# Altium schematic sheet Power.SchDoc
size 406 x 304 mm; SheetNumber: 2; SheetTotal: 8
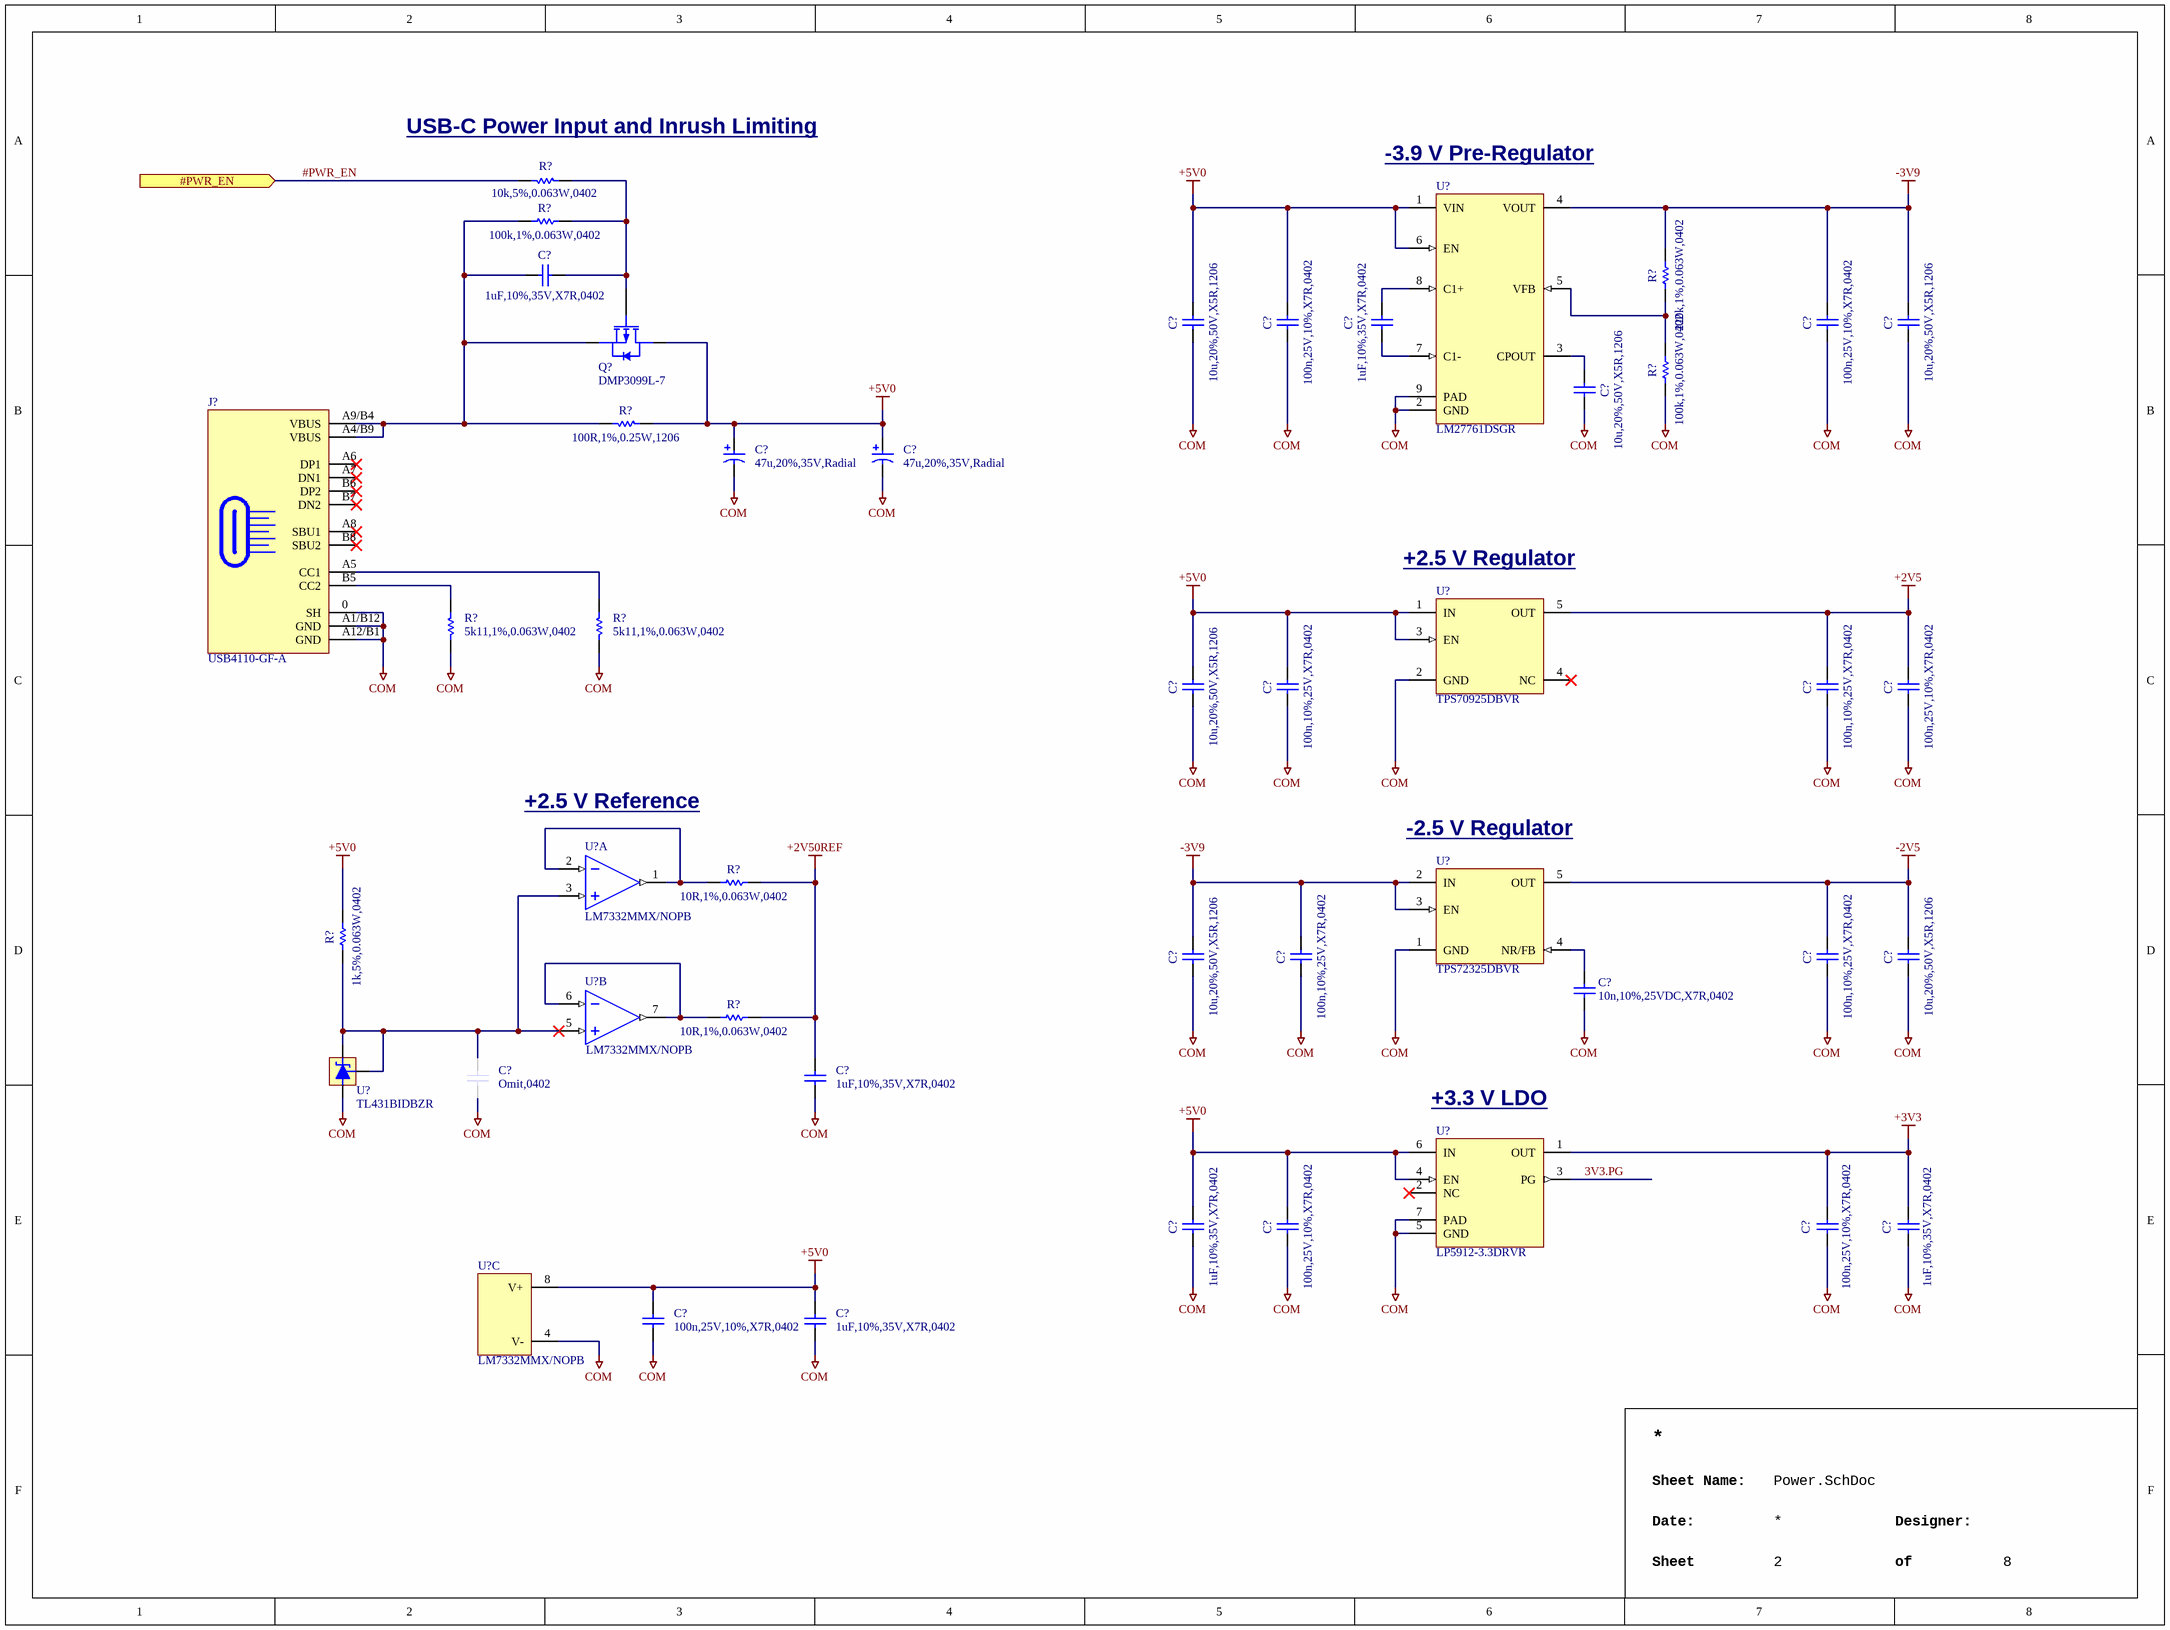
[diagram p0: Power.SchDoc]

## Parts
(Parts that share a designator on the sheet are numbered #1, #2 ... from top to bottom, then left to right.)
C?#1  1uF,10%,35V,X7R,0402  [CAPC1005X06N]
C?#2  10u,20%,50V,X5R,1206  [CAPC3216X16N]
C?#3  100n,25V,10%,X7R,0402  [CAPC1005X06N]
C?#4  1uF,10%,35V,X7R,0402  [CAPC1005X06N]
C?#5  100n,25V,10%,X7R,0402  [CAPC1005X06N]
C?#6  10u,20%,50V,X5R,1206  [CAPC3216X16N]
C?#7  10u,20%,50V,X5R,1206  [CAPC3216X16N]
C?#8  47u,20%,35V,Radial  [KEMET_ESKXXXXXXXXC3XX]
C?#9  47u,20%,35V,Radial  [KEMET_ESKXXXXXXXXC3XX]
C?#10  10u,20%,50V,X5R,1206  [CAPC3216X16N]
C?#11  100n,10%,25V,X7R,0402  [CAPC1005X06N]
C?#12  100n,10%,25V,X7R,0402  [CAPC1005X06N]
C?#13  100n,25V,10%,X7R,0402  [CAPC1005X06N]
C?#14  10u,20%,50V,X5R,1206  [CAPC3216X16N]
C?#15  100n,10%,25V,X7R,0402  [CAPC1005X06N]
C?#16  100n,10%,25V,X7R,0402  [CAPC1005X06N]
C?#17  10u,20%,50V,X5R,1206  [CAPC3216X16N]
C?#18  10n,10%,25VDC,X7R,0402  [CAPC1005X06N]
C?#19  Omit,0402  [CAPC1005X06N]  (no BOM)
C?#20  1uF,10%,35V,X7R,0402  [CAPC1005X06N]
C?#21  1uF,10%,35V,X7R,0402  [CAPC1005X06N]
C?#22  100n,25V,10%,X7R,0402  [CAPC1005X06N]
C?#23  100n,25V,10%,X7R,0402  [CAPC1005X06N]
C?#24  1uF,10%,35V,X7R,0402  [CAPC1005X06N]
C?#25  100n,25V,10%,X7R,0402  [CAPC1005X06N]
C?#26  1uF,10%,35V,X7R,0402  [CAPC1005X06N]
J?  USB4110-GF-A  [GCT_USB4110-GF-A]
Q?  DMP3099L-7  [DIODES_SOT23]
R?#1  10k,5%,0.063W,0402  [RESC1005X04N]
R?#2  100k,1%,0.063W,0402  [RESC1005X04N]
R?#3  220k,1%,0.063W,0402  [RESC1005X04N]
R?#4  100k,1%,0.063W,0402  [RESC1005X04N]
R?#5  100R,1%,0.25W,1206  [SEI_PKG_RMCF1206]
R?#6  5k11,1%,0.063W,0402  [RESC1005X04N]
R?#7  5k11,1%,0.063W,0402  [RESC1005X04N]
R?#8  10R,1%,0.063W,0402  [RESC1005X04N]
R?#9  1k,5%,0.063W,0402  [RESC1005X04N]
R?#10  10R,1%,0.063W,0402  [RESC1005X04N]
U?#1  LM27761DSGR  [TEXASINSTRUMENTS_PKG_DSG0008A]
U?#2  TPS70925DBVR  [TEXASINSTRUMENTS_PKG_DBV0005A]
U?#3  LM7332MMX/NOPB  [TEXASINSTRUMENTS_PKG_DGK0008A]  (part A of 3)
U?#4  TPS72325DBVR  [TEXASINSTRUMENTS_PKG_DBV0005A]
U?#5  LM7332MMX/NOPB  [TEXASINSTRUMENTS_PKG_DGK0008A]  (part B of 3)
U?#6  TL431BIDBZR  [SOT95P240X120-3N]
U?#7  LP5912-3.3DRVR  [SON65P200X80-6N]
U?#8  LM7332MMX/NOPB  [TEXASINSTRUMENTS_PKG_DGK0008A]  (part C of 3)

## Ports
#PWR_EN (in)

## Nets
+2V5: C?#12.2 C?#13.2 U?#2.5(OUT)
+2V50REF: C?#20.2 R?#8.2 R?#10.2
+3V3: C?#23.2 C?#24.2 U?#7.1(OUT)
+5V0: C?#2.2 C?#3.2 C?#8.1 C?#9.1 C?#10.2 C?#11.2 C?#21.2 C?#22.2 C?#25.2 C?#26.2 Q?.3(D) R?#5.1 R?#9.2 U?#1.1(VIN) U?#1.6(EN) U?#2.1(IN) U?#2.3(EN) U?#7.4(EN) U?#7.6(IN) U?#8.8(V+)
-2V5: C?#16.2 C?#17.2 U?#4.5(OUT)
-3V9: C?#5.2 C?#6.2 C?#14.2 C?#15.2 R?#3.1 U?#1.4(VOUT) U?#4.2(IN) U?#4.3(EN)
COM: C?#2.1 C?#3.1 C?#5.1 C?#6.1 C?#7.1 C?#8.2 C?#9.2 C?#10.1 C?#11.1 C?#12.1 C?#13.1 C?#14.1 C?#15.1 C?#16.1 C?#17.1 C?#18.1 C?#19.1 C?#20.1 C?#21.1 C?#22.1 C?#23.1 C?#24.1 C?#25.1 C?#26.1 J?.0(SH) J?.A1/B12(GND) J?.A12/B1(GND) R?#4.2 R?#6.2 R?#7.2 U?#1.2(GND) U?#1.9(PAD) U?#2.2(GND) U?#4.1(GND) U?#6.3 U?#7.5(GND) U?#7.7(PAD) U?#8.4(V-)
3V3.PG: U?#7.3(PG)
#PWR_EN: R?#1.1 ; port #PWR_EN
NetC?#1_1: C?#1.1 Q?.1(G) R?#1.2 R?#2.2
NetC?#1_2: C?#1.2 J?.A4/B9(VBUS) J?.A9/B4(VBUS) Q?.2(S) R?#2.1 R?#5.2
NetC?#4_1: C?#4.1 U?#1.7(C1-)
NetC?#4_2: C?#4.2 U?#1.8(C1+)
NetC?#7_2: C?#7.2 U?#1.3(CPOUT)
NetC?#18_2: C?#18.2 U?#4.4(NR/FB)
NetC?#19_2: C?#19.2 R?#9.1 U?#3.3(INA+) U?#5.5(INB+) U?#6.1 U?#6.2
NetJ?_A5: J?.A5(CC1) R?#7.1
NetJ?_B5: J?.B5(CC2) R?#6.1
NetR?#3_2: R?#3.2 R?#4.1 U?#1.5(VFB)
NetR?#8_1: R?#8.1 U?#3.1(OUTA) U?#3.2(INA-)
NetR?#10_1: R?#10.1 U?#5.6(INB-) U?#5.7(OUTB)

Not connected (* = marked no-connect by the designer): J? A6(DP1)* A7(DN1)* A8(SBU1)* B6(DP2)* B7(DN2)* B8(SBU2)*; U?#2 4(NC)*; U?#7 2(NC)*

## Notes on the sheet
- (near R?#1) USB-C Power Input and Inrush Limiting
- (near U?#1) -3.9 V Pre-Regulator
- (near U?#2) +2.5 V Regulator
- +2.5 V Reference
- (near U?#4) -2.5 V Regulator
- (near U?#7) +3.3 V LDO
- Sheet Name:
- Date:
- Sheet
- Designer:
- of

## Library data of the parts
C?#1 C?#4 C?#20 C?#21 C?#24 C?#26 = CAP,Cer,1uF,35VDC,X5R,0402: 1 ï¿½F ï¿½10% 35V Ceramic Capacitor X5R 0402 (1005 Metric); Manufacturer 1: TDK Corporation; Manufacturer 1 Part Number: C1005X5R1V105K050BC; Vendor 1 Part Number: 445-9073-1-ND; Vendor 1: Digikey; Value: 1u; Part Name: CAP,Cer,1uF,35VDC,X5R,0402; CreatedBy: Judd Foster; HelpURL: https://product.tdk.com/info/en/catalog/datasheets/mlcc_commercial_general_en.pdf?ref_disty=digikey
C?#2 C?#6 C?#7 C?#10 C?#14 C?#17 = CAP,Cer,10uF,50VDC,X5R,1206: 10ï¿½F ï¿½20% 50V Ceramic Capacitor X5R 1206 (3216 Metric); Manufacturer 1: Samsung Electro-Mechanics; Manufacturer 1 Part Number: CL31A106MBHNNNE; Vendor 1 Part Number: 1276-6736-1-ND; Vendor 1: Digikey; Part Name: CAP,Cer,10uF,50VDC,X5R,1206; CreatedBy: Judd Foster; HelpURL: https://www.samsungsem.com/resources/file/global/support/product_catalog/MLCC.pdf; Value: 10u
C?#3 C?#5 C?#13 C?#22 C?#23 C?#25 = CAP,Cer,100nF,10%,25VDC,X7R,0402: 0.1ï¿½F ï¿½10% 25V Ceramic Capacitor X7R 0402 (1005 Metric); Manufacturer 1: Murata Electronics; Manufacturer 1 Part Number: GRM155R71E104KE14J; Vendor 1 Part Number: 490-14603-1-ND; Vendor 1: DigiKey; Value: 100nF; Part Name: CAP,Cer,100nF,10%,25VDC,X7R,0402; CreatedBy: Judd Foster; HelpURL: https://search.murata.co.jp/Ceramy/image/img/A01X/G101/ENG/GRM155R71E104KE14-01.pdf
C?#8 C?#9 = CAP,Alum,47uF,20%,35V,Radial: 47 ÂµF 35 V Aluminum Electrolytic Capacitors Radial, Can 2000 Hrs @ 85Â°C; Manufacturer 1: KEMET; Manufacturer 1 Part Number: ESK476M035AC3EA; Vendor 1 Part Number: 399-18276-1-ND; Vendor 1: Digikey; Part Name: CAP,Alum,47uF,20%,35V,Radial; CreatedBy: Judd Foster; HelpURL: https://connect.kemet.com:7667/gateway/IntelliData-ComponentDocumentation/1.0/download/datasheet/ESK476M035AC3EA; Value: 47u
C?#11 C?#12 C?#15 C?#16 = CAP,Cer,100nF,10%,25V,X7R,0402: 0.1ï¿½F ï¿½10% 25V Ceramic Capacitor X7R 0402 (1005 Metric); Manufacturer 1: Murata Electronics; Manufacturer 1 Part Number: GRM155R71E104KE14J; Vendor 1 Part Number: 490-14603-1-ND; Vendor 1: DigiKey; Value: 100nF; Part Name: CAP,Cer,100nF,10%,25V,X7R,0402; CreatedBy: Judd Foster; HelpURL: https://search.murata.co.jp/Ceramy/image/img/A01X/G101/ENG/GRM155R71E104KE14-01.pdf
C?#18 = CAP,Cer,10nF,10%,25VDC,X7R,0402: 10000pF ï¿½10% 25V Ceramic Capacitor X7R 0402 (1005 Metric); Manufacturer 1: Murata Electronics; Manufacturer 1 Part Number: GCM155R71E103KA37D; Vendor 1 Part Number: 490-6043-1-ND; Vendor 1: Digikey; Part Name: CAP,Cer,10nF,10%,25VDC,X7R,0402; CreatedBy: Judd Foster; HelpURL: https://psearch.en.murata.com/capacitor/product/GCM155R71E103KA37%23.pdf; Value: 10n,10%,25VDC,X7R,0402
C?#19 = CAP,Omit,0402: Omit; Part Name: CAP,Omit,0402; CreatedBy: Judd Foster; HelpURL: N/A; Manufacturer 1: N/A; Manufacturer 1 Part Number: N/A; Vendor 1: N/A; Vendor 1 Part Number: N/A; Value: Omit
J? = Conn,USB_C,SMD: USB-C (USB TYPE-C) USB 2.0 Receptacle Connector 24 (16+8 Dummy) Position Surface Mount, Right Angle; Manufacturer 1: GCT; Vendor 1 Part Number: 2073-USB4110-GF-A-1-ND; Vendor 1: Digikey; Part Name: Conn,USB_C,SMD; CreatedBy: Judd Foster; HelpURL: https://gct.co/files/drawings/usb4110.pdf; Manufacturer 1 Part Number: USB4110-GF-A
Q? = MOSFET,P Ch,30V,3.8A: P-Channel 30 V 3.8A (Ta) 1.08W (Ta) Surface Mount SOT-23-3; Manufacturer 1: Diodes Incorporated; Vendor 1 Part Number: DMP3099L-7DICT-ND; Vendor 1: Digikey; Part Name: MOSFET,P Ch,30V,3.8A; CreatedBy: Judd Foster; HelpURL: https://www.diodes.com/assets/Datasheets/DMP3099L.pdf; Manufacturer 1 Part Number: DMP3099L-7
R?#1 = RES,10k,5%,0.063W,0402: 10 kOhms ï¿½5% 0.063W, 1/16W Chip Resistor 0402 (1005 Metric) Automotive AEC-Q200 Thick Film; Manufacturer 1: Stackpole Electronics Inc; Manufacturer 1 Part Number: RMCF0402JT10K0; Vendor 1 Part Number: RMCF0402JT10K0CT-ND; Vendor 1: DIgikey; Part Name: RES,10k,5%,0.063W,0402; CreatedBy: Judd Foster; HelpURL: https://www.seielect.com/catalog/sei-rmcf_rmcp.pdf; Value: 10k
R?#2 R?#4 = RES,100k,1%,0.063W,0402: 100 kOhms Â±1% 0.063W, 1/16W Chip Resistor 0402 (1005 Metric) Moisture Resistant Thick Film; Manufacturer 1: YAGEO; Manufacturer 1 Part Number: RC0402FR-07100KL; Vendor 1 Part Number: 311-100KLRCT-ND; Vendor 1: DigiKey; Part Name: RES,100k,1%,0.063W,0402; CreatedBy: Judd Foster; HelpURL: https://www.yageo.com/upload/media/product/products/datasheet/rchip/PYu-RC_Group_51_RoHS_L_12.pdf; Value: 100k
R?#3 = RES,220k,1%,0.063W,0402: 220 kOhms Â±1% 0.063W, 1/16W Chip Resistor 0402 (1005 Metric) Moisture Resistant Thick Film; Manufacturer 1: YAGEO; Manufacturer 1 Part Number: RC0402FR-07220KL; Vendor 1 Part Number: 311-220KLRCT-ND; Vendor 1: Digikey; Part Name: RES,220k,1%,0.063W,0402; CreatedBy: Judd Foster; HelpURL: https://www.yageo.com/upload/media/product/products/datasheet/rchip/PYu-RC_Group_51_RoHS_L_12.pdf; Value: 220k
R?#5 = RES,100R,1%,0.25W,1206: 100 Ohms Â±1% 0.25W, 1/4W Chip Resistor 1206 (3216 Metric) Automotive AEC-Q200 Thick Film; Manufacturer 1: Stackpole Electronics Inc; Manufacturer 1 Part Number: RMCF1206FT100R; Vendor 1 Part Number: RMCF1206FT100RCT-ND; Vendor 1: DigiKey; Part Name: RES,100R,1%,0.25W,1206; CreatedBy: Judd Foster; HelpURL: https://www.seielect.com/catalog/sei-rmcf_rmcp.pdf; Value: 100R
R?#6 R?#7 = RES,5k11,1%,0.063W,0402: 5.11 kOhms ï¿½1% 0.063W, 1/16W Chip Resistor 0402 (1005 Metric) Automotive AEC-Q200, Moisture Resistant Thick Film; Manufacturer 1: Yageo; Manufacturer 1 Part Number: AC0402FR-075K11L; Vendor 1 Part Number: 13-AC0402FR-075K11LCT-ND; Vendor 1: Digikey; Part Name: RES,5k11,1%,0.063W,0402; CreatedBy: Judd Foster; HelpURL: https://www.yageo.com/upload/media/product/productsearch/datasheet/rchip/PYu-AC_51_RoHS_L_7.pdf; Value: 5k11
R?#8 R?#10 = RES,10R,1%,0.063W,0402: 10 Ohms ï¿½1% 0.063W, 1/16W Chip Resistor 0402 (1005 Metric) Automotive AEC-Q200 Thick Film; Manufacturer 1: Panasonic Electronic Components; Manufacturer 1 Part Number: ERJ-2RKF10R0X; Vendor 1 Part Number: P10.0LCT-ND; Vendor 1: Digikey; Part Name: RES,10R,1%,0.063W,0402; CreatedBy: Judd Foster; HelpURL: https://industrial.panasonic.com/cdbs/www-data/pdf/RDA0000/AOA0000C304.pdf; Value: 10R
R?#9 = RES,1k,5%,0.063W,0402: 1 kOhms ï¿½5% 0.063W, 1/16W Chip Resistor 0402 (1005 Metric) Automotive AEC-Q200 Thick Film; Manufacturer 1: Stackpole Electronics Inc; Manufacturer 1 Part Number: RMCF0402JT1K00; Vendor 1 Part Number: RMCF0402JT1K00CT-ND; Vendor 1: DIgikey; Part Name: RES,1k,5%,0.063W,0402; CreatedBy: Judd Foster; HelpURL: https://www.seielect.com/catalog/sei-rmcf_rmcp.pdf; Value: 1k
U?#1 = LM27761DSGR: Charge Pump Switching Regulator IC Negative Adjustable -1.5V 1 Output 250mA 8-WFDFN Exposed Pad; Manufacturer 1: Texas Instruments; Vendor 1 Part Number: 296-44379-1-ND; Vendor 1: DigiKey; Part Name: LM27761DSGR; CreatedBy: Judd Foster; HelpURL: https://www.ti.com/lit/ds/symlink/lm27761.pdf?HQS=dis-dk-null-digikeymode-dsf-pf-null-wwe&ts=1736913234763&ref_url=https%253A%252F%252Fwww.ti.com%252Fgeneral%252Fdocs%252Fsuppproductinfo.tsp%253FdistId%253D10%2526gotoUrl%253Dhttps%253A%252F%252Fwww.ti.com; Manufacturer 1 Part Number: LM27761DSGR
U?#2 = TPS70925DBVR: Linear Voltage Regulator IC Positive Fixed 1 Output 150mA SOT-23-5; Manufacturer 1: Texas Instruments; Vendor 1 Part Number: 296-40923-1-ND; Vendor 1: DigiKey; Part Name: TPS70925DBVR; CreatedBy: Judd Foster; HelpURL: https://www.ti.com/lit/ds/symlink/tps709.pdf?HQS=dis-dk-null-digikeymode-dsf-pf-null-wwe&ts=1736883811582; Manufacturer 1 Part Number: TPS70925DBVR
U?#3 U?#5 U?#8 = LM7332MMX_NOPB: General Purpose Amplifier 2 Circuit Rail-to-Rail 8-VSSOP; Manufacturer 1: Texas Instruments; Vendor 1 Part Number: 296-LM7332MMX/NOPBCT-ND; Vendor 1: DigiKey; Part Name: LM7332MMX_NOPB; CreatedBy: Judd Foster; HelpURL: https://www.ti.com/lit/ds/symlink/lm7332.pdf?HQS=dis-dk-null-digikeymode-dsf-pf-null-wwe&ts=1730932081789&ref_url=https%253A%252F%252Fwww.ti.com%252Fgeneral%252Fdocs%252Fsuppproductinfo.tsp%253FdistId%253D10%2526gotoUrl%253Dhttps%253A%252F%252Fwww.ti.com%; Manufacturer 1 Part Number: LM7332MMX/NOPB
U?#4 = TPS72325DBVR: Linear Voltage Regulator IC Negative Fixed 1 Output 200mA SOT-23-5; Manufacturer 1: Texas Instruments; Vendor 1 Part Number: 296-39479-1-ND; Vendor 1: DigiKey; Part Name: TPS72325DBVR; CreatedBy: Judd Foster; HelpURL: https://www.ti.com/lit/ds/symlink/tps723.pdf?HQS=dis-dk-null-digikeymode-dsf-pf-null-wwe&ts=1736917966718&ref_url=https%253A%252F%252Fwww.ti.com%252Fgeneral%252Fdocs%252Fsuppproductinfo.tsp%253FdistId%253D10%2526gotoUrl%253Dhttps%253A%252F%252Fwww.ti.com%; Manufacturer 1 Part Number: TPS72325DBVR
U?#6 = TL431BIDBZR: IC VREF SHUNT 36V 0.5% SOT23-3; Manufacturer 1: Texas Instruments; Vendor 1 Part Number: 296-18872-1-ND; Vendor 1: Digikey; Part Name: TL431BIDBZR; CreatedBy: Judd Foster; HelpURL: http://www.ti.com/lit/ds/symlink/tl431.pdf; Manufacturer 1 Part Number: TL431BIDBZR
U?#7 = LP5912-3.3DRVR: Linear Voltage Regulator IC Positive Fixed 1 Output 500mA 6-WSON (2x2); Manufacturer 1: Texas Instruments; Vendor 1 Part Number: 296-47214-1-ND; Vendor 1: Digikey; Part Name: LP5912-3.3DRVR; CreatedBy: Judd Foster; HelpURL: http://www.ti.com/general/docs/suppproductinfo.tsp?distId=10&gotoUrl=http%3A%2F%2Fwww.ti.com%2Flit%2Fgpn%2Flp5912; Manufacturer 1 Part Number: LP5912-3.3DRVR